# EAGLE design STM32F429VIT6-v1.0.0 (EAGLE 7.7.0)

## Sheet 1 of 3
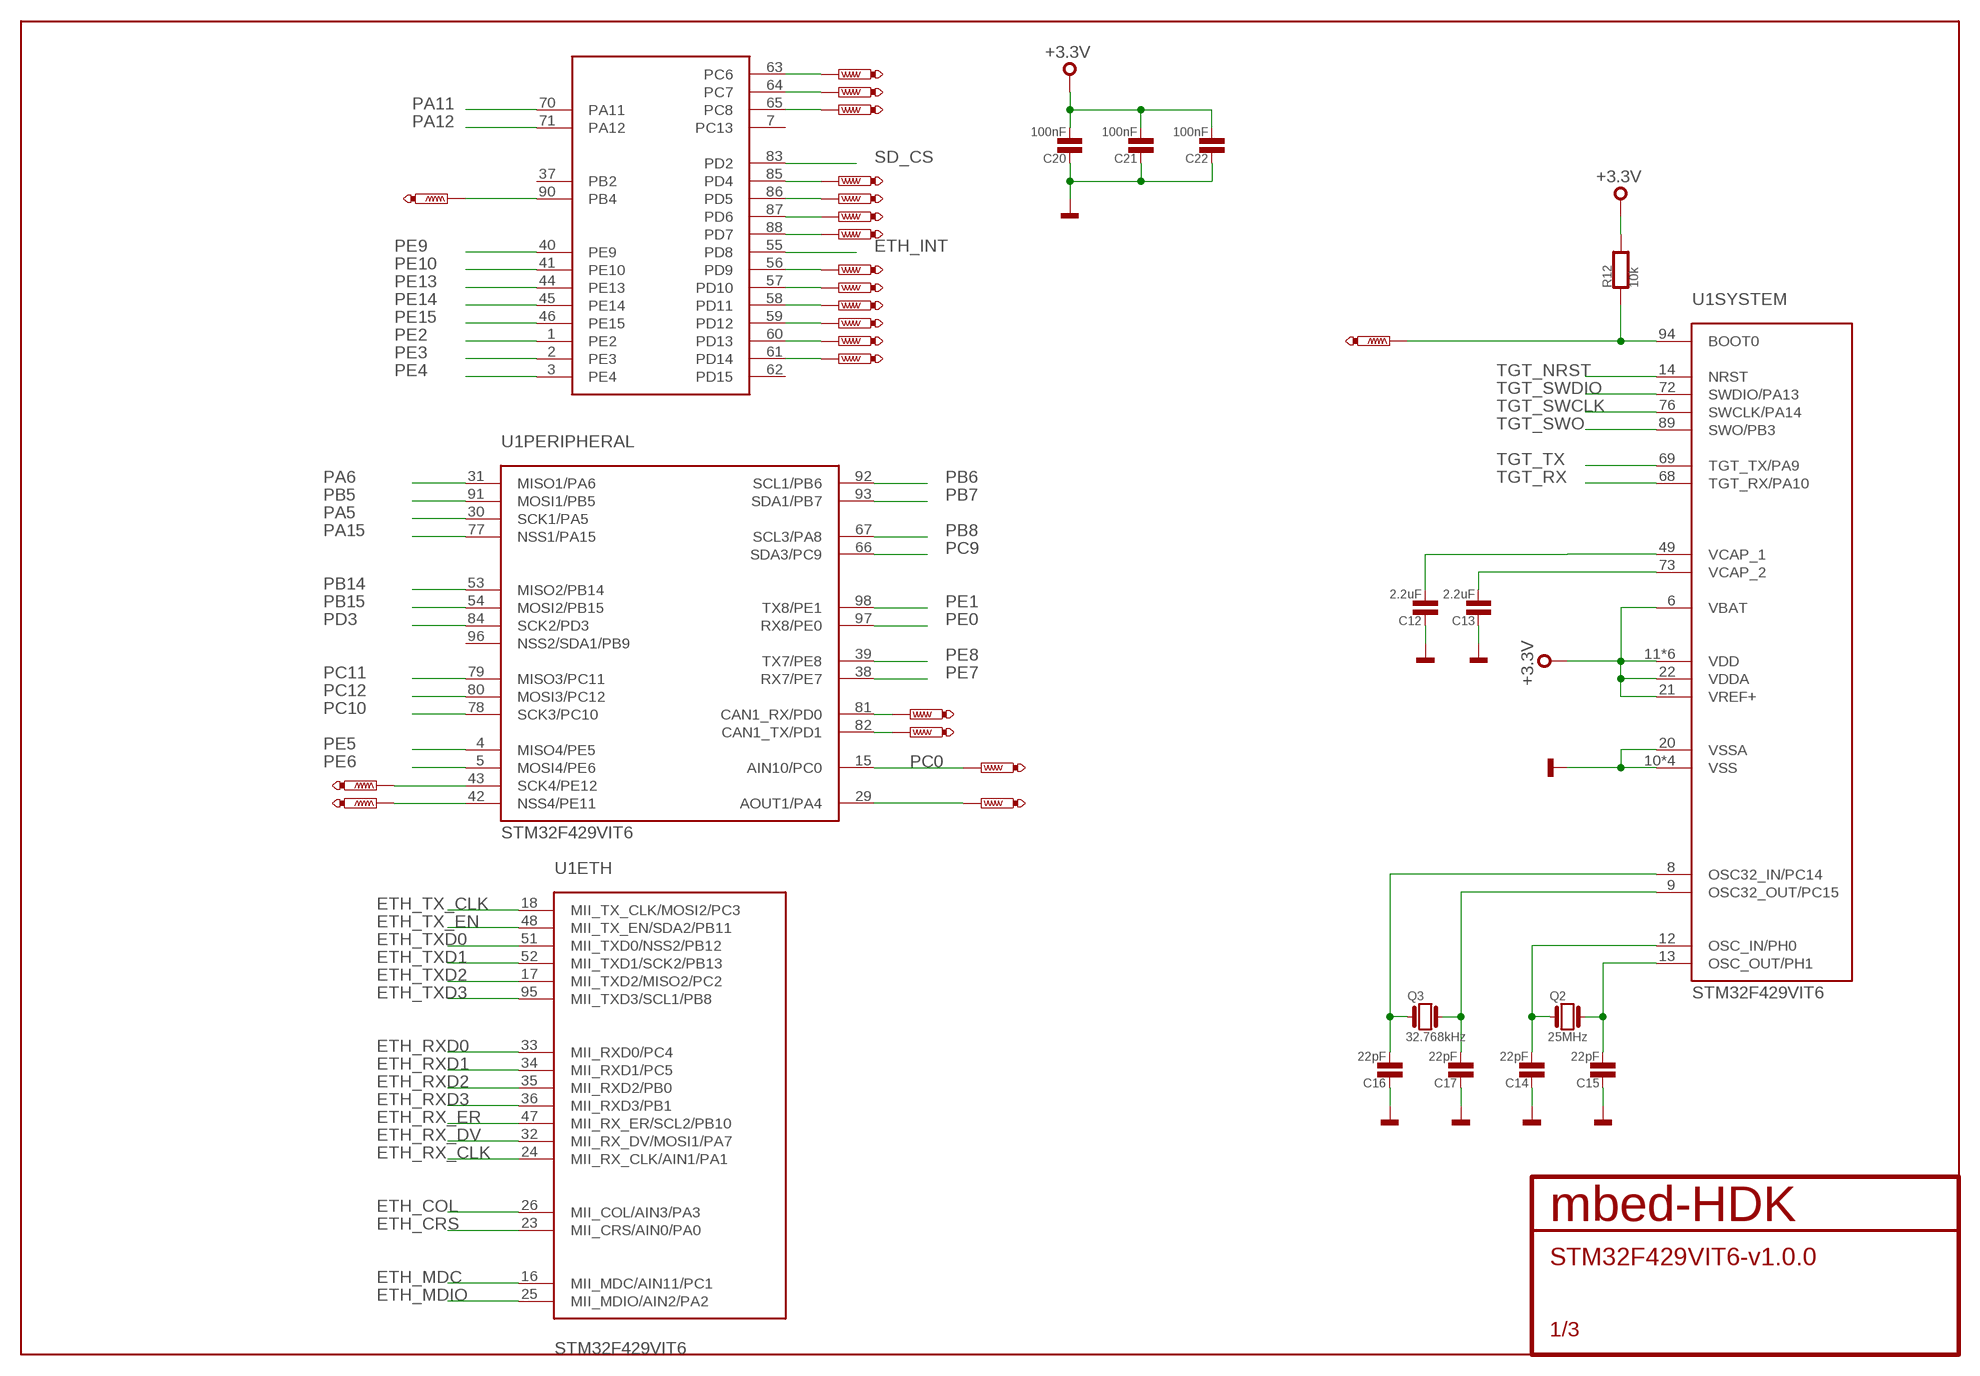
[diagram p0: schematic, sheet 1]

### Parts
C12  2.2uF  C0402  [0402]
C13  2.2uF  C0402  [0402]
C14  22pF  C0603  [0603]
C15  22pF  C0603  [0603]
C16  22pF  C0603  [0603]
C17  22pF  C0603  [0603]
C20  100nF  C0402  [0402]
C21  100nF  C0402  [0402]
C22  100nF  C0402  [0402]
Q2  25MHz  GENERIC-CRYSTAL_3.2X2.5  [3.2X.2.5]
Q3  32.768kHz  GENERIC-CRYSTAL_FC135  [FC135]
R12  10k  R0402  [0402]
TP3  PTR1TP06R  [TP06R]
TP4  PTR1TP06R  [TP06R]
TP5  PTR1TP06R  [TP06R]
TP6  PTR1TP06R  [TP06R]
TP7  PTR1TP06R  [TP06R]
TP8  PTR1TP06R  [TP06R]
TP9  PTR1TP06R  [TP06R]
TP10  PTR1TP06R  [TP06R]
TP11  PTR1TP06R  [TP06R]
TP12  PTR1TP06R  [TP06R]
TP13  PTR1TP06R  [TP06R]
TP15  PTR1TP06R  [TP06R]
TP16  PTR1TP06R  [TP06R]
TP17  PTR1TP06R  [TP06R]
TP18  PTR1TP06R  [TP06R]
TP19  PTR1TP06R  [TP06R]
TP20  PTR1TP06R  [TP06R]
TP21  PTR1TP06R  [TP06R]
TP22  PTR1TP06R  [TP06R]
TP23  PTR1TP06R  [TP06R]
TP24  PTR1TP06R  [TP06R]
U1  STM32F429VIT6  [QFP50P1600X1600X160-100N]

### Nets
+3.3V: C20.2 C21.2 C22.2 R12.2 U1.6(SYSTEM:VBAT) U1.11(SYSTEM:VDD) U1.19(SYSTEM:VDD) U1.21(SYSTEM:VREF+) U1.22(SYSTEM:VDDA) U1.28(SYSTEM:VDD) U1.50(SYSTEM:VDD) U1.75(SYSTEM:VDD) U1.100(SYSTEM:VDD) ; also sheet 2,3
ETH_COL: U1.26(ETH:MII_COL/AIN3/PA3) ; also sheet 2
ETH_CRS: U1.23(ETH:MII_CRS/AIN0/PA0) ; also sheet 2
ETH_INT: U1.55(GPIO:PD8) ; also sheet 2
ETH_MDC: U1.16(ETH:MII_MDC/AIN11/PC1) ; also sheet 2
ETH_MDIO: U1.25(ETH:MII_MDIO/AIN2/PA2) ; also sheet 2
ETH_RX_CLK: U1.24(ETH:MII_RX_CLK/AIN1/PA1) ; also sheet 2
ETH_RX_DV: U1.32(ETH:MII_RX_DV/MOSI1/PA7) ; also sheet 2
ETH_RX_ER: U1.47(ETH:MII_RX_ER/SCL2/PB10) ; also sheet 2
ETH_RXD0: U1.33(ETH:MII_RXD0/PC4) ; also sheet 2
ETH_RXD1: U1.34(ETH:MII_RXD1/PC5) ; also sheet 2
ETH_RXD2: U1.35(ETH:MII_RXD2/PB0) ; also sheet 2
ETH_RXD3: U1.36(ETH:MII_RXD3/PB1) ; also sheet 2
ETH_TX_CLK: U1.18(ETH:MII_TX_CLK/MOSI2/PC3) ; also sheet 2
ETH_TX_EN: U1.48(ETH:MII_TX_EN/SDA2/PB11) ; also sheet 2
ETH_TXD0: U1.51(ETH:MII_TXD0/NSS2/PB12) ; also sheet 2
ETH_TXD1: U1.52(ETH:MII_TXD1/SCK2/PB13) ; also sheet 2
ETH_TXD2: U1.17(ETH:MII_TXD2/MISO2/PC2) ; also sheet 2
ETH_TXD3: U1.95(ETH:MII_TXD3/SCL1/PB8) ; also sheet 2
GND: C12.1 C13.1 C14.1 C15.1 C16.1 C17.1 C20.1 C21.1 C22.1 U1.10(SYSTEM:VSS) U1.20(SYSTEM:VSSA) U1.27(SYSTEM:VSS) U1.74(SYSTEM:VSS) U1.99(SYSTEM:VSS) ; also sheet 2,3
N$3: R12.1 TP6.TP U1.94(SYSTEM:BOOT0)
N$8: TP3.TP U1.81(PERIPHERAL:CAN1_RX/PD0)
N$10: C12.2 U1.49(SYSTEM:VCAP_1)
N$11: C14.2 Q2.P$1 U1.12(SYSTEM:OSC_IN/PH0)
N$12: C15.2 Q2.P$3 U1.13(SYSTEM:OSC_OUT/PH1)
N$13: C17.2 Q3.X2 U1.9(SYSTEM:OSC32_OUT/PC15)
N$14: C13.2 U1.73(SYSTEM:VCAP_2)
N$15: C16.2 Q3.X1 U1.8(SYSTEM:OSC32_IN/PC14)
N$16: TP4.TP U1.82(PERIPHERAL:CAN1_TX/PD1)
N$17: TP7.TP U1.29(PERIPHERAL:AOUT1/PA4)
N$18: TP8.TP U1.42(PERIPHERAL:NSS4/PE11)
N$19: TP9.TP U1.43(PERIPHERAL:SCK4/PE12)
N$20: TP18.TP U1.88(GPIO:PD7)
N$21: TP11.TP U1.90(GPIO:PB4)
N$22: TP21.TP U1.85(GPIO:PD4)
N$23: TP20.TP U1.86(GPIO:PD5)
N$24: TP19.TP U1.87(GPIO:PD6)
N$25: TP17.TP U1.65(GPIO:PC8)
N$26: TP16.TP U1.64(GPIO:PC7)
N$28: TP15.TP U1.63(GPIO:PC6)
N$29: TP12.TP U1.60(GPIO:PD13)
N$31: TP13.TP U1.56(GPIO:PD9)
N$32: TP10.TP U1.57(GPIO:PD10)
N$34: TP22.TP U1.58(GPIO:PD11)
N$35: TP23.TP U1.59(GPIO:PD12)
N$36: TP24.TP U1.61(GPIO:PD14)
PA5: U1.30(PERIPHERAL:SCK1/PA5) ; also sheet 3
PA6: U1.31(PERIPHERAL:MISO1/PA6) ; also sheet 3
PA11: U1.70(GPIO:PA11) ; also sheet 3
PA12: U1.71(GPIO:PA12) ; also sheet 3
PA15: U1.77(PERIPHERAL:NSS1/PA15) ; also sheet 3
PB5: U1.91(PERIPHERAL:MOSI1/PB5) ; also sheet 3
PB6: U1.92(PERIPHERAL:SCL1/PB6) ; also sheet 3
PB7: U1.93(PERIPHERAL:SDA1/PB7) ; also sheet 3
PB8: U1.67(PERIPHERAL:SCL3/PA8) ; also sheet 3
PB14: U1.53(PERIPHERAL:MISO2/PB14) ; also sheet 3
PB15: U1.54(PERIPHERAL:MOSI2/PB15) ; also sheet 3
PC0: TP5.TP U1.15(PERIPHERAL:AIN10/PC0) ; also sheet 3
PC9: U1.66(PERIPHERAL:SDA3/PC9) ; also sheet 3
PC10: U1.78(PERIPHERAL:SCK3/PC10) ; also sheet 3
PC11: U1.79(PERIPHERAL:MISO3/PC11) ; also sheet 3
PC12: U1.80(PERIPHERAL:MOSI3/PC12) ; also sheet 3
PD3: U1.84(PERIPHERAL:SCK2/PD3) ; also sheet 3
PE0: U1.97(PERIPHERAL:RX8/PE0) ; also sheet 3
PE1: U1.98(PERIPHERAL:TX8/PE1) ; also sheet 3
PE2: U1.1(GPIO:PE2) ; also sheet 3
PE3: U1.2(GPIO:PE3) ; also sheet 3
PE4: U1.3(GPIO:PE4) ; also sheet 3
PE5: U1.4(PERIPHERAL:MISO4/PE5) ; also sheet 3
PE6: U1.5(PERIPHERAL:MOSI4/PE6) ; also sheet 3
PE7: U1.38(PERIPHERAL:RX7/PE7) ; also sheet 3
PE8: U1.39(PERIPHERAL:TX7/PE8) ; also sheet 3
PE9: U1.40(GPIO:PE9) ; also sheet 3
PE10: U1.41(GPIO:PE10) ; also sheet 3
PE13: U1.44(GPIO:PE13) ; also sheet 3
PE14: U1.45(GPIO:PE14) ; also sheet 3
PE15: U1.46(GPIO:PE15) ; also sheet 3
SD_CS: U1.83(GPIO:PD2) ; also sheet 3
TGT_NRST: U1.14(SYSTEM:NRST) ; also sheet 2,3
TGT_RX: U1.68(SYSTEM:TGT_RX/PA10) ; also sheet 3
TGT_SWCLK: U1.76(SYSTEM:SWCLK/PA14) ; also sheet 3
TGT_SWDIO: U1.72(SYSTEM:SWDIO/PA13) ; also sheet 3
TGT_SWO: U1.89(SYSTEM:SWO/PB3) ; also sheet 3
TGT_TX: U1.69(SYSTEM:TGT_TX/PA9) ; also sheet 3
Unconnected: U1.7(GPIO:PC13) U1.37(GPIO:PB2) U1.62(GPIO:PD15) U1.96(PERIPHERAL:NSS2/SDA1/PB9)

## Sheet 2 of 3
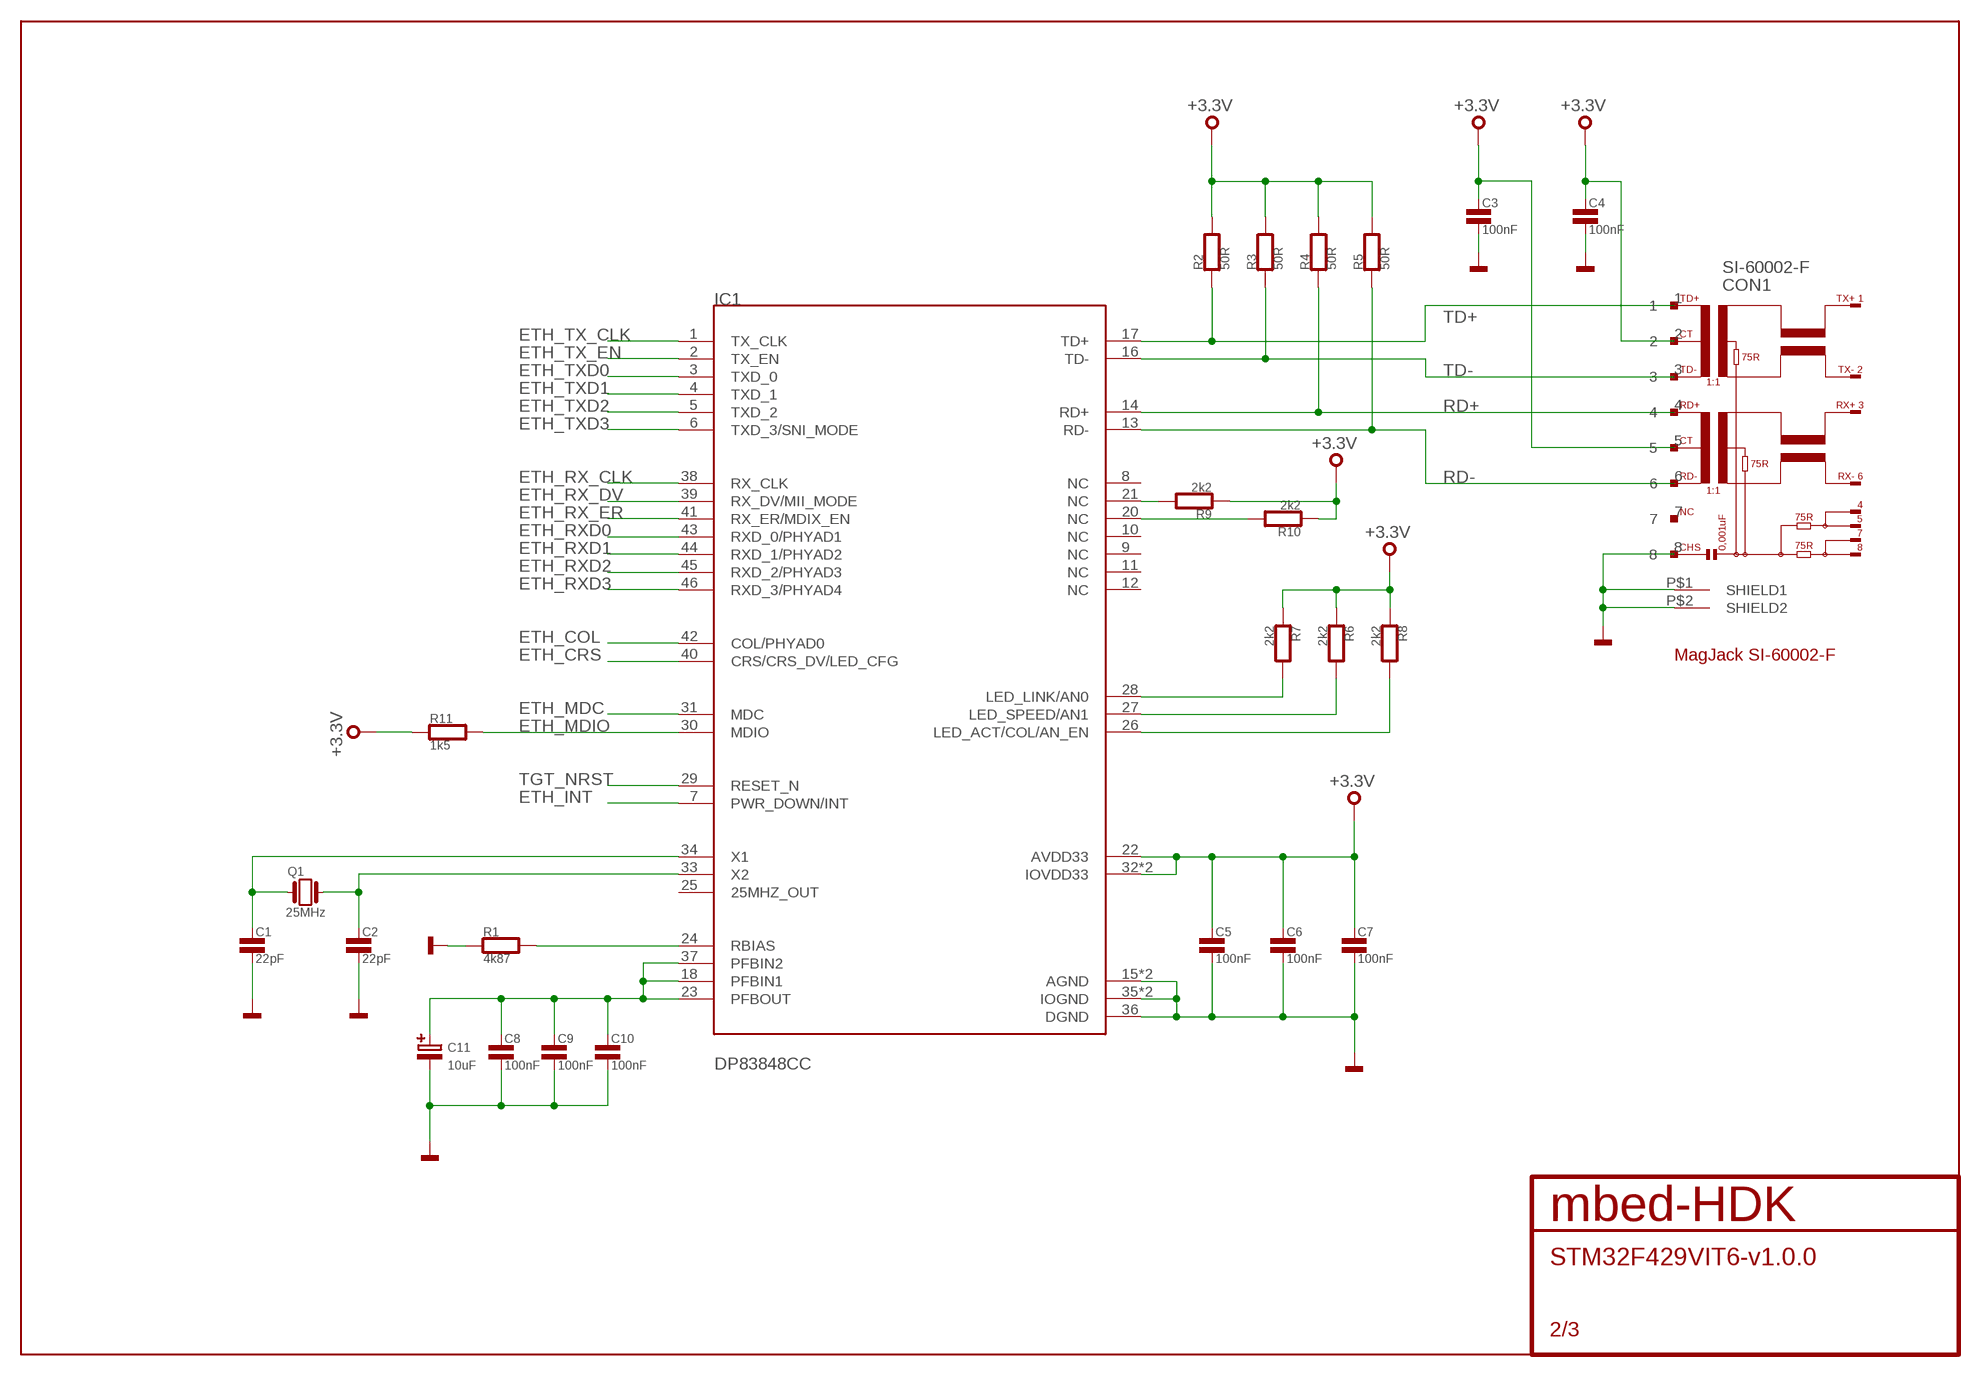
[diagram p1: schematic, sheet 2]

### Parts
C1  22pF  C0402  [0402]
C2  22pF  C0402  [0402]
C3  100nF  C0402  [0402]
C4  100nF  C0402  [0402]
C5  100nF  C0402  [0402]
C6  100nF  C0402  [0402]
C7  100nF  C0402  [0402]
C8  100nF  C0402  [0402]
C9  100nF  C0402  [0402]
C10  100nF  C0402  [0402]
C11  10uF  C-POLA  [SMC_A]
CON1  SI-60002-F  [RJ45]
IC1  DP83848CC  [LQFP-48]
Q1  25MHz  GENERIC-CRYSTAL_3.2X2.5  [3.2X.2.5]
R1  4k87  R0402  [0402]
R2  50R  R0402  [0402]
R3  50R  R0402  [0402]
R4  50R  R0402  [0402]
R5  50R  R0402  [0402]
R6  2k2  R0402  [0402]
R7  2k2  R0402  [0402]
R8  2k2  R0402  [0402]
R9  2k2  R0402  [0402]
R10  2k2  R0402  [0402]
R11  1k5  R0402  [0402]

### Nets
+3.3V: C3.1 C4.1 C5.1 C6.1 C7.1 CON1.2 CON1.5 IC1.22(AVDD33) IC1.32(IOVDD33) IC1.48(IOVDD33) R2.2 R3.2 R4.2 R5.2 R6.1 R7.1 R8.1 R9.1 R10.1 R11.1 ; also sheet 1,3
ETH_COL: IC1.42(COL/PHYAD0) ; also sheet 1
ETH_CRS: IC1.40(CRS/CRS_DV/LED_CFG) ; also sheet 1
ETH_INT: IC1.7(PWR_DOWN/INT) ; also sheet 1
ETH_MDC: IC1.31(MDC) ; also sheet 1
ETH_MDIO: IC1.30(MDIO) R11.2 ; also sheet 1
ETH_RX_CLK: IC1.38(RX_CLK) ; also sheet 1
ETH_RX_DV: IC1.39(RX_DV/MII_MODE) ; also sheet 1
ETH_RX_ER: IC1.41(RX_ER/MDIX_EN) ; also sheet 1
ETH_RXD0: IC1.43(RXD_0/PHYAD1) ; also sheet 1
ETH_RXD1: IC1.44(RXD_1/PHYAD2) ; also sheet 1
ETH_RXD2: IC1.45(RXD_2/PHYAD3) ; also sheet 1
ETH_RXD3: IC1.46(RXD_3/PHYAD4) ; also sheet 1
ETH_TX_CLK: IC1.1(TX_CLK) ; also sheet 1
ETH_TX_EN: IC1.2(TX_EN) ; also sheet 1
ETH_TXD0: IC1.3(TXD_0) ; also sheet 1
ETH_TXD1: IC1.4(TXD_1) ; also sheet 1
ETH_TXD2: IC1.5(TXD_2) ; also sheet 1
ETH_TXD3: IC1.6(TXD_3/SNI_MODE) ; also sheet 1
GND: C1.2 C2.2 C3.2 C4.2 C5.2 C6.2 C7.2 C8.2 C9.2 C10.2 C11.- CON1.8 CON1.P$1(SHIELD1) CON1.P$2(SHIELD2) IC1.15(AGND) IC1.19(AGND) IC1.35(IOGND) IC1.36(DGND) IC1.47(IOGND) R1.1 ; also sheet 1,3
N$1: C1.1 IC1.34(X1) Q1.P$1
N$2: C2.1 IC1.33(X2) Q1.P$3
N$4: IC1.28(LED_LINK/AN0) R7.2
N$5: IC1.24(RBIAS) R1.2
N$6: IC1.27(LED_SPEED/AN1) R6.2
N$7: IC1.26(LED_ACT/COL/AN_EN) R8.2
N$9: IC1.21(NC) R9.2
N$27: IC1.20(NC) R10.2
N$33: C8.1 C9.1 C10.1 C11.+ IC1.18(PFBIN1) IC1.23(PFBOUT) IC1.37(PFBIN2)
RD+: CON1.4 IC1.14(RD+) R4.1
RD-: CON1.6 IC1.13(RD-) R5.1
TD+: CON1.1 IC1.17(TD+) R2.1
TD-: CON1.3 IC1.16(TD-) R3.1
TGT_NRST: IC1.29(RESET_N) ; also sheet 1,3
Unconnected: CON1.7 IC1.8(NC) IC1.9(NC) IC1.10(NC) IC1.11(NC) IC1.12(NC) IC1.25(25MHZ_OUT)

## Sheet 3 of 3
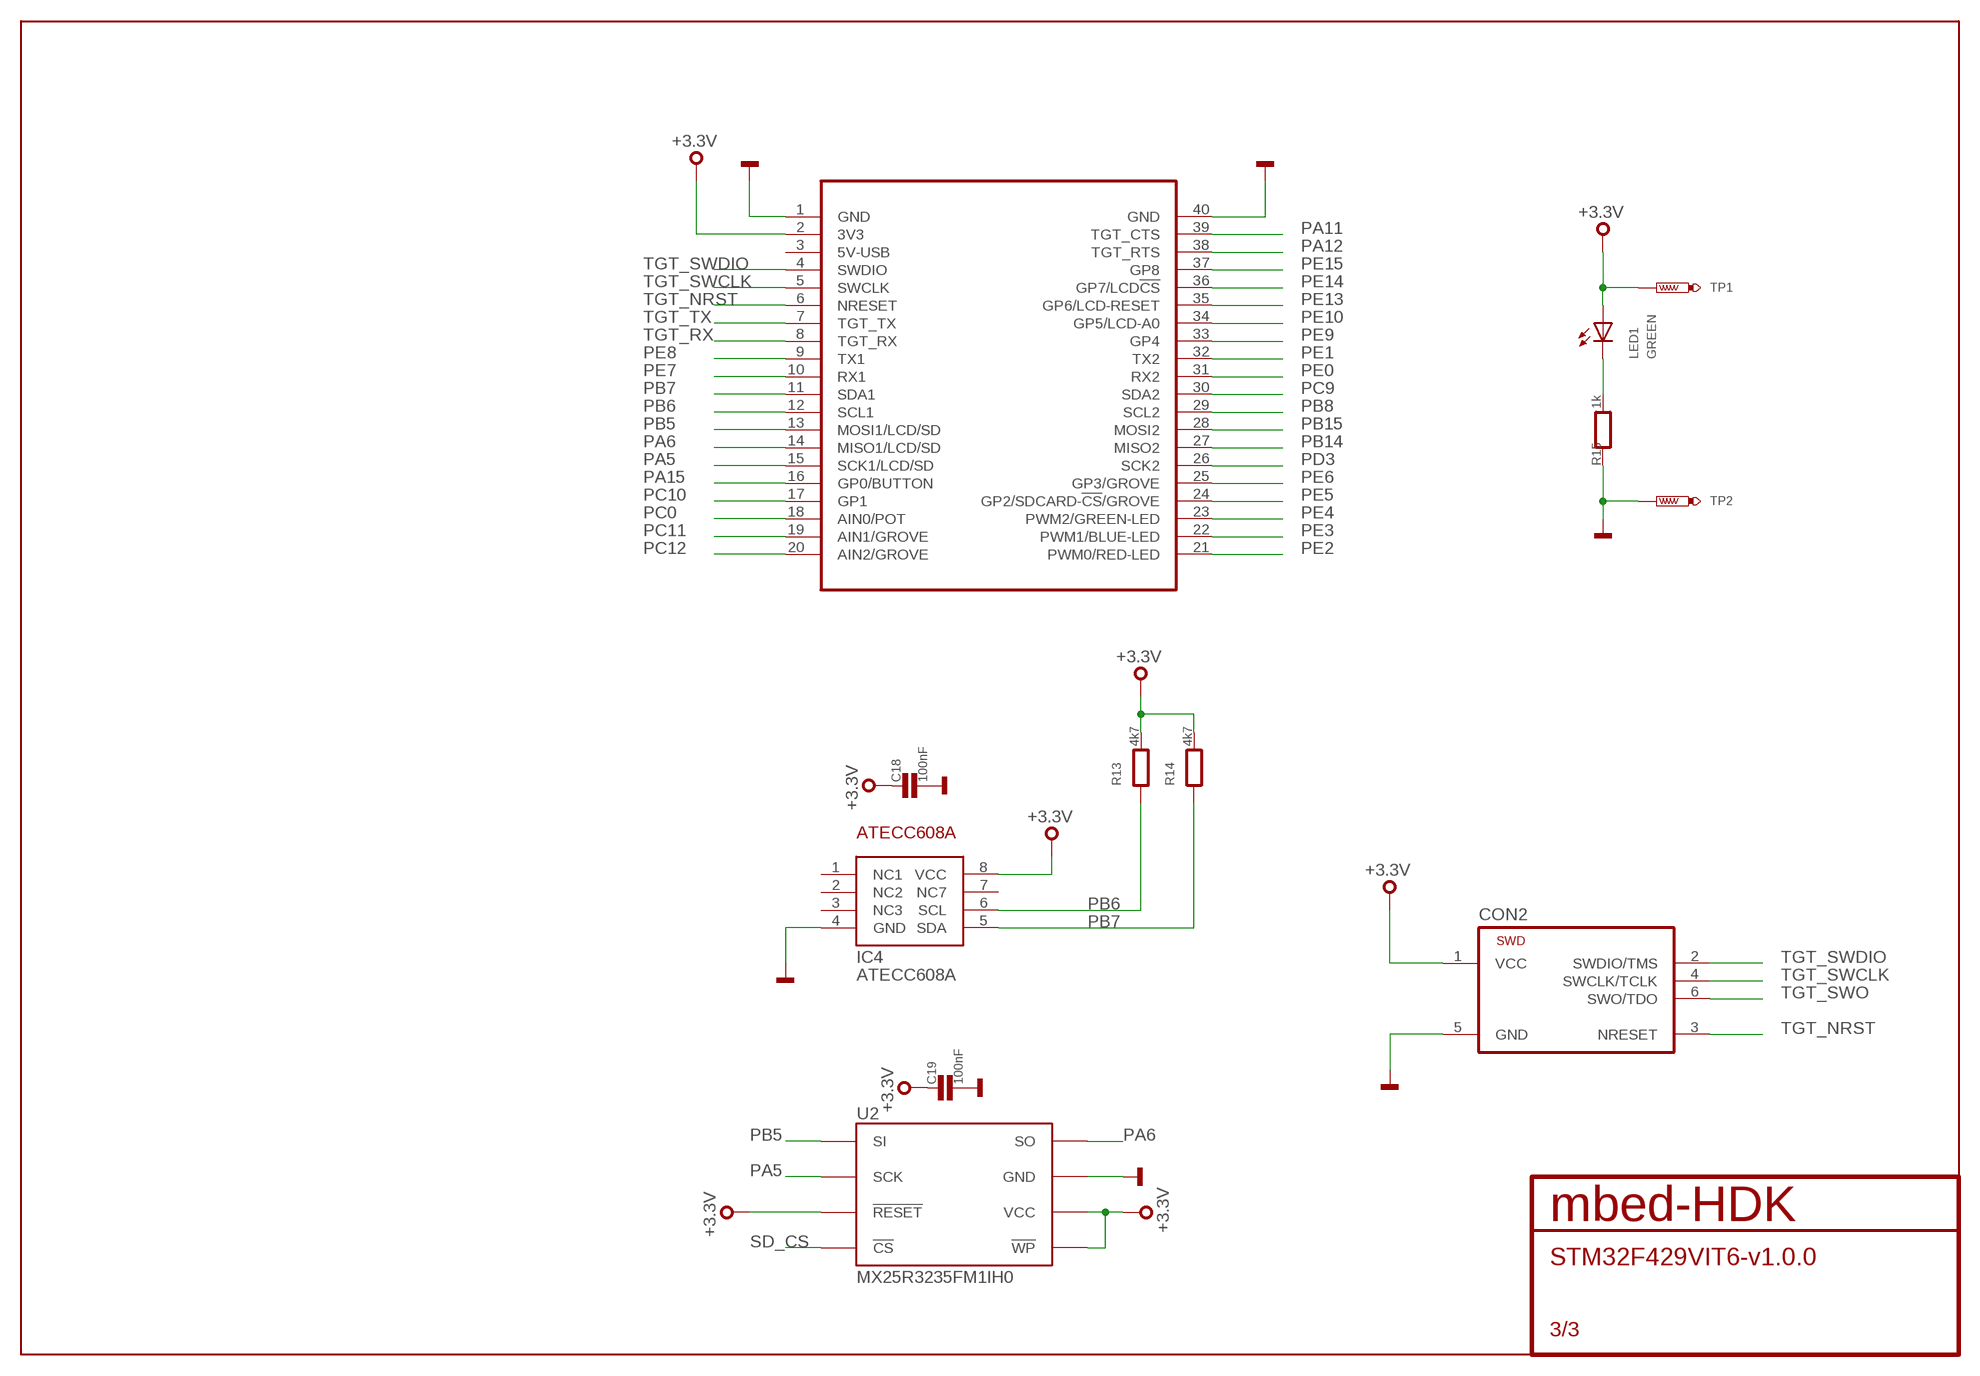
[diagram p2: schematic, sheet 3]

### Parts
C18  100nF  CAPACITOR0402  [0402]
C19  100nF  CAPACITOR0402  [0402]
CON2  TC2030-CTX-NL  [TC2030-CTX-NL]
IC4  ATECC608A  [SO8]
LED1  GREEN  SMD_LED0603  [CHIPLED_0603]
MOD1  MODULE_DAUGHTER  [MODULE_DAUGHTER]
R13  4k7  RESISTOR0402  [0402]
R14  4k7  RESISTOR0402  [0402]
R15  1k  RESISTOR0603  [0603]
TP1  TEST-POINT-50R-PTH  [TP50-PTH]
TP2  TEST-POINT-50R-PTH  [TP50-PTH]
U2  MX25R3235FM1IH0  [SO8]

### Nets
+3.3V: C18.1 C19.1 CON2.1(VCC) IC4.8(VCC) LED1.A MOD1.2(3V3) R13.2 R14.2 TP1.TP U2.3(!WP) U2.7(!RESET) U2.8(VCC) ; also sheet 1,2
GND: C18.2 C19.2 CON2.5(GND) IC4.4(GND) MOD1.1(GND) MOD1.40(GND) R15.1 TP2.TP U2.4(GND) ; also sheet 1,2
PA5: MOD1.15(SCK1/LCD/SD) U2.6(SCK) ; also sheet 1
PA6: MOD1.14(MISO1/LCD/SD) U2.2(SO) ; also sheet 1
PA11: MOD1.39(TGT_CTS) ; also sheet 1
PA12: MOD1.38(TGT_RTS) ; also sheet 1
PA15: MOD1.16(GP0/BUTTON) ; also sheet 1
PA_1: LED1.C R15.2
PB5: MOD1.13(MOSI1/LCD/SD) U2.5(SI) ; also sheet 1
PB6: IC4.6(SCL) MOD1.12(SCL1) R13.1 ; also sheet 1
PB7: IC4.5(SDA) MOD1.11(SDA1) R14.1 ; also sheet 1
PB8: MOD1.29(SCL2) ; also sheet 1
PB14: MOD1.27(MISO2) ; also sheet 1
PB15: MOD1.28(MOSI2) ; also sheet 1
PC0: MOD1.18(AIN0/POT) ; also sheet 1
PC9: MOD1.30(SDA2) ; also sheet 1
PC10: MOD1.17(GP1) ; also sheet 1
PC11: MOD1.19(AIN1/GROVE) ; also sheet 1
PC12: MOD1.20(AIN2/GROVE) ; also sheet 1
PD3: MOD1.26(SCK2) ; also sheet 1
PE0: MOD1.31(RX2) ; also sheet 1
PE1: MOD1.32(TX2) ; also sheet 1
PE2: MOD1.21(PWM0/RED-LED) ; also sheet 1
PE3: MOD1.22(PWM1/BLUE-LED) ; also sheet 1
PE4: MOD1.23(PWM2/GREEN-LED) ; also sheet 1
PE5: MOD1.24(GP2/SDCARD-!CS!/GROVE) ; also sheet 1
PE6: MOD1.25(GP3/GROVE) ; also sheet 1
PE7: MOD1.10(RX1) ; also sheet 1
PE8: MOD1.9(TX1) ; also sheet 1
PE9: MOD1.33(GP4) ; also sheet 1
PE10: MOD1.34(GP5/LCD-A0) ; also sheet 1
PE13: MOD1.35(GP6/LCD-RESET) ; also sheet 1
PE14: MOD1.36(GP7/LCD!CS) ; also sheet 1
PE15: MOD1.37(GP8) ; also sheet 1
SD_CS: U2.1(!CS) ; also sheet 1
TGT_NRST: CON2.3(NRESET) MOD1.6(NRESET) ; also sheet 1,2
TGT_RX: MOD1.8(TGT_RX) ; also sheet 1
TGT_SWCLK: CON2.4(SWCLK/TCLK) MOD1.5(SWCLK) ; also sheet 1
TGT_SWDIO: CON2.2(SWDIO/TMS) MOD1.4(SWDIO) ; also sheet 1
TGT_SWO: CON2.6(SWO/TDO) ; also sheet 1
TGT_TX: MOD1.7(TGT_TX) ; also sheet 1
Unconnected: IC4.1(NC1) IC4.2(NC2) IC4.3(NC3) IC4.7(NC7) MOD1.3(5V-USB)

## Library data of the parts
C1-C10 C12-C17 C20-C22 = mbed-HDK-RLC:C: Capacitor
C11 = mbed-HDK-RLC:C-POL: Polarised capacitor
C18 C19 = mbed-HDK-RLC:CAPACITOR: Capacitor
CON1 = mbed-HDK-Connector:SI-60002-F: RJ45 Right Angle; MF: Stewart Connector; MFN: SI-60002-F; OC-DIGIKEY: 380-1105-ND; OC-NEWARK: 24M7449
CON2 = mbed-HDK-Connector:TC2030-CTX: Tag-Connect In Circuit Programming & Debug Cable 6 Pin
IC1 = mbed-HDK-IC:DP83848C
IC4 = mbed-HDK-MF-ATMEL:ATECC608A
LED1 = mbed-HDK-Optical:SMD_LED: LED SMD, Colour Red; MF: Wurth Electronics Inc; MFN: 150060RS75000; OC-DIGIKEY: 732-4978-1-ND; OC-MOUSER: 710-150060RS75000; OC-NEWARK: 2322071
MOD1 = mbed-HDK-misc-Board:MODULE_DAUGHTER
Q1-Q3 = mbed-HDK-Oscillator:GENERIC-CRYSTAL: GENERIC Crystal
R1-R12 = mbed-HDK-RLC:R: Resistor
R13-R15 = mbed-HDK-RLC:RESISTOR: Resistor
TP1 TP2 = mbed-HDK:TEST-POINT
TP3-TP13 TP15-TP24 = testpad:PTR1: TEST PIN
U1 = mbed-HDK-MF-ST:STM32F429VIT6
U2 = mbed-HDK-IC:MX25R3235FM1IH0: Serial Flash 32 Mb 80 Mhz; MF: Macronix; MFN: MX25R3235FM1IH0; OC-DIGIKEY: 1092-1175-ND

## Board
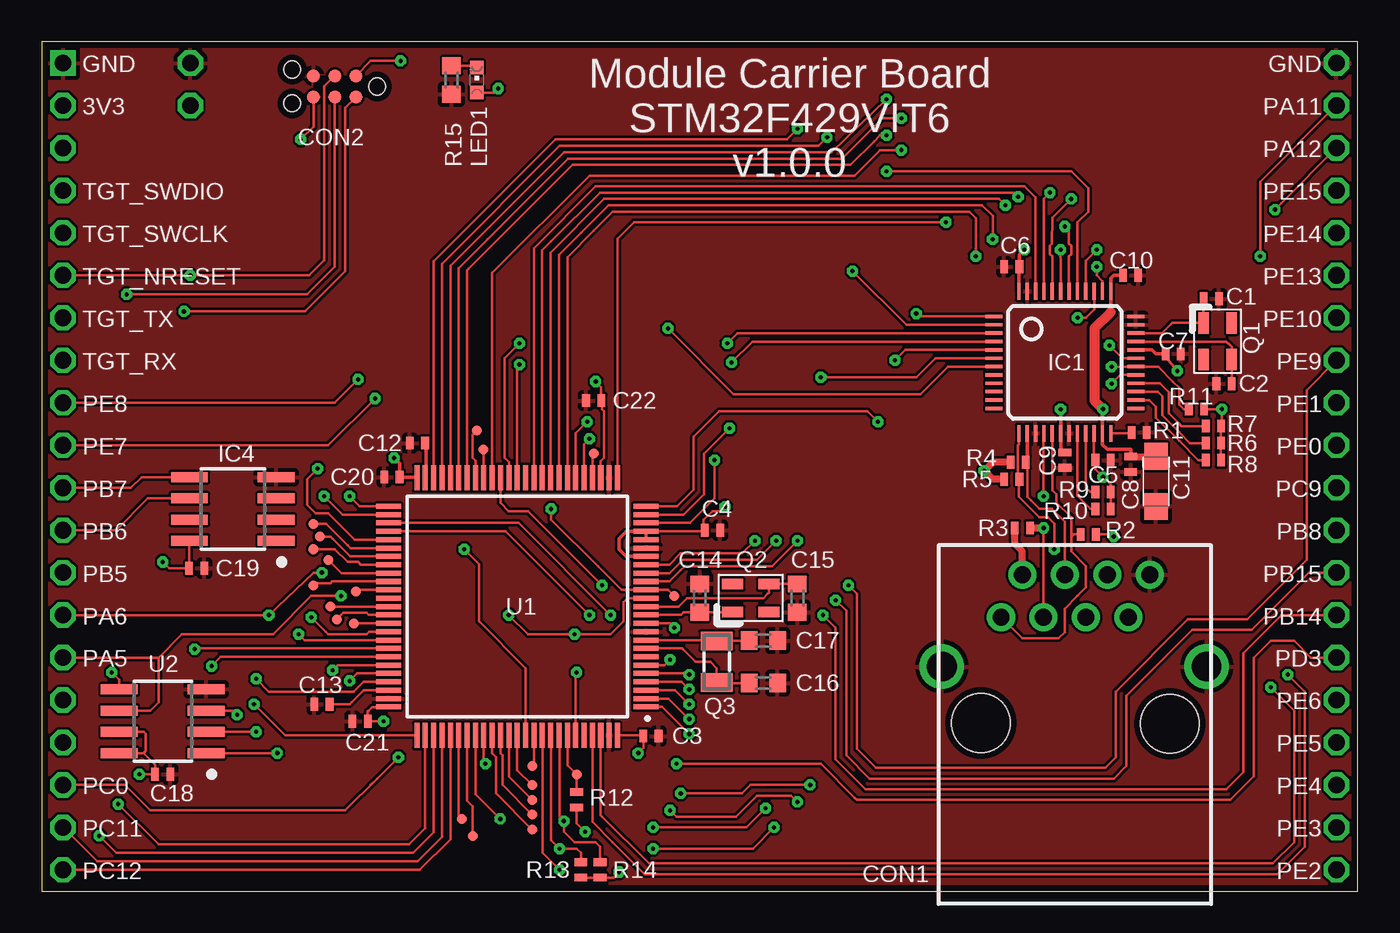
[diagram p3: board, top side]
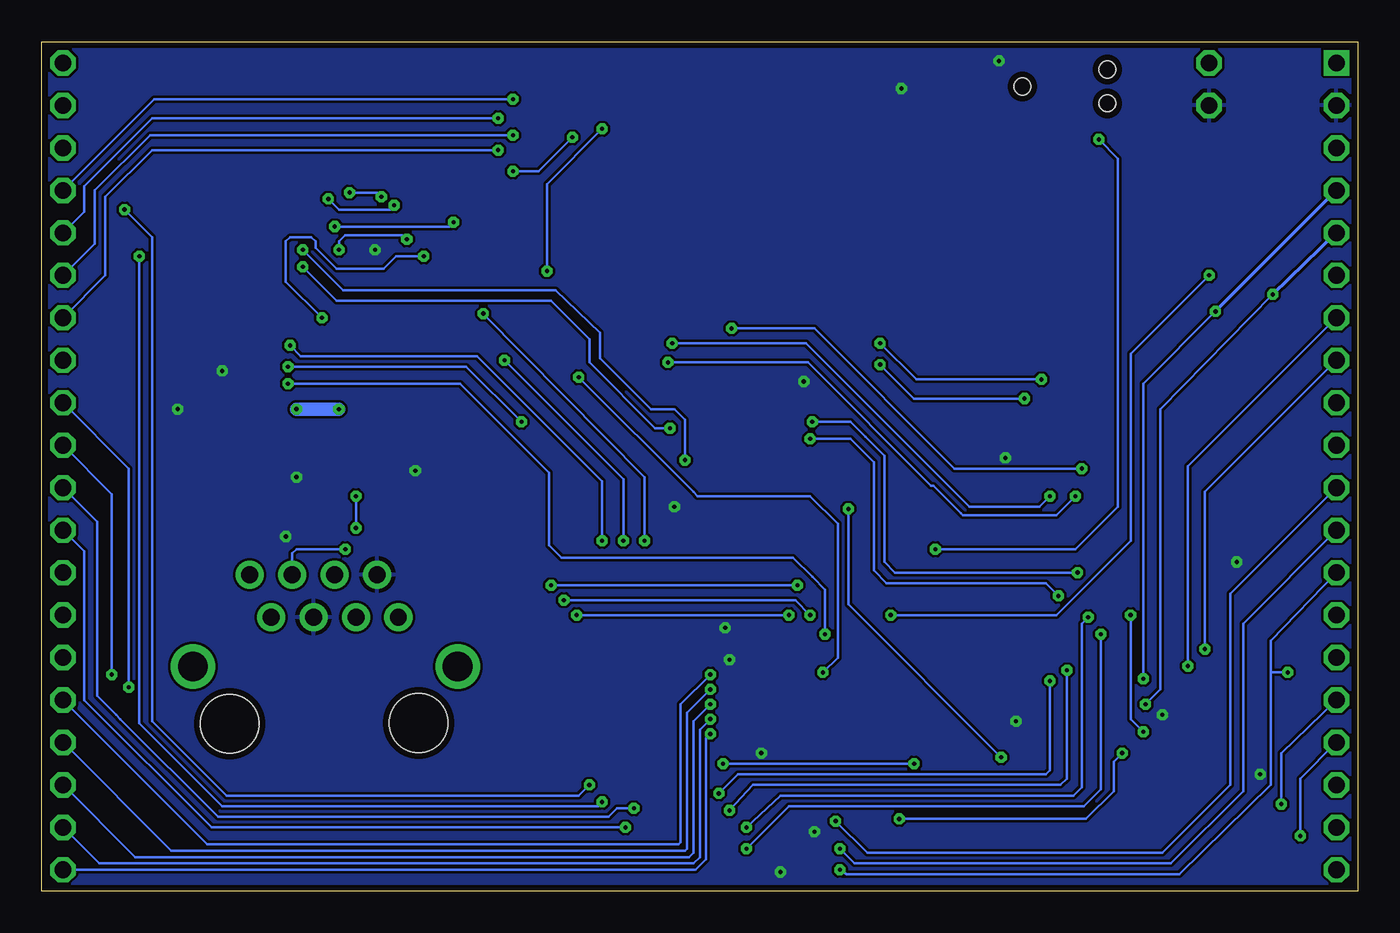
[diagram p4: board, bottom side, seen from below]

Size 78.74 x 50.8 mm. Coordinates in mm from the lower left corner, seen from the top.
Copper layers ((1*16)): Top 0.035mm / dielectric 0.8mm / Bottom 0.035mm
Design rules "mbed-HDK-6-6-2-layer": minimum track width 6mil, minimum drill 9mil, track to track 6mil, track to pad 6mil, pad to pad 6mil, via to via 6mil, smd to smd 6mil, copper to edge 15mil, drill to drill 8mil, minimum pad ring 10mil, minimum via ring 8mil, stop-mask expansion 4mil, vias tented up to drill 0mil, thermal gap 10mil

### Footprints (pad centres in the part's own frame; a part is rotated, then mirrored left to right if it is on the bottom)
0402 = smd 0.457 x 0.762: 1 -0.457,0; 2 0.457,0
SMC_A = smd 1.6 x 1.4: + -1.5,0; - 1.5,0
0603 = smd 1 x 1.1: 1 -0.85,0; 2 0.85,0
RJ45 = drill 1.016 pad 1.676: 1 0,0; 2 -1.27,-2.54; 3 -2.54,0; 4 -3.81,-2.54; 5 -5.08,0; 6 -6.35,-2.54; 7 -7.62,0; 8 -8.89,-2.54 | drill 1.778: P$1 -12.3,2.95; P$2 3.55,2.95 | hole 3.5: -10.09,6.38; 1.21,6.33
TC2030-CTX-NL = smd 0.787 x 0.787: 1 -1.27,-0.635; 2 -1.27,0.635; 3 0,-0.635; 4 0,0.635; 5 1.27,-0.635; 6 1.27,0.635 | hole 0.991: -2.54,0; 2.54,1.016; 2.54,-1.016
LQFP-48 = smd 0.2 x 1: 1 -2.75,-4.25; 2 -2.25,-4.25; 3 -1.75,-4.25; 4 -1.25,-4.25; 5 -0.75,-4.25; 6 -0.25,-4.25; 7 0.25,-4.25; 8 0.75,-4.25; 9 1.25,-4.25; 10 1.75,-4.25; 11 2.25,-4.25; 12 2.75,-4.25; 25 2.75,4.25; 26 2.25,4.25; 27 1.75,4.25; 28 1.25,4.25; 29 0.75,4.25; 30 0.25,4.25; 31 -0.25,4.25; 32 -0.75,4.25; 33 -1.25,4.25; 34 -1.75,4.25; 35 -2.25,4.25; 36 -2.75,4.25 | smd 1 x 0.2: 13 4.25,-2.75; 14 4.25,-2.25; 15 4.25,-1.75; 16 4.25,-1.25; 17 4.25,-0.75; 18 4.25,-0.25; 19 4.25,0.25; 20 4.25,0.75; 21 4.25,1.25; 22 4.25,1.75; 23 4.25,2.25; 24 4.25,2.75; 37 -4.25,2.75; 38 -4.25,2.25; 39 -4.25,1.75; 40 -4.25,1.25; 41 -4.25,0.75; 42 -4.25,0.25; 43 -4.25,-0.25; 44 -4.25,-0.75; 45 -4.25,-1.25; 46 -4.25,-1.75; 47 -4.25,-2.25; 48 -4.25,-2.75
SO8 = smd 0.6 x 2.2: 1 -1.905,-2.6; 2 -0.635,-2.6; 3 0.635,-2.6; 4 1.905,-2.6; 5 1.905,2.6; 6 0.635,2.6; 7 -0.635,2.6; 8 -1.905,2.6
CHIPLED_0603 = smd 0.8 x 0.8: A 0,-0.75; C 0,0.75
MODULE_DAUGHTER = drill 1 square: 1 0,0 | drill 1 octagon: 2 0,-2.54; 3 0,-5.08; 4 0,-7.62; 5 0,-10.16; 6 0,-12.7; 7 0,-15.24; 8 0,-17.78; 9 0,-20.32; 10 0,-22.86; 11 0,-25.4; 12 0,-27.94; 13 0,-30.48; 14 0,-33.02; 15 0,-35.56; 16 0,-38.1; 17 0,-40.64; 18 0,-43.18; 19 0,-45.72; 20 0,-48.26; 21 76.2,-48.26; 22 76.2,-45.72; 23 76.2,-43.18; 24 76.2,-40.64; 25 76.2,-38.1; 26 76.2,-35.56; 27 76.2,-33.02; 28 76.2,-30.48; 29 76.2,-27.94; 30 76.2,-25.4; 31 76.2,-22.86; 32 76.2,-20.32; 33 76.2,-17.78; 34 76.2,-15.24; 35 76.2,-12.7; 36 76.2,-10.16; 37 76.2,-7.62; 38 76.2,-5.08; 39 76.2,-2.54; 40 76.2,0
3.2X.2.5 = smd 1.27 x 0.635: P$1 -1.092,-0.838; P$2 1.092,-0.838; P$3 1.092,0.838; P$4 -1.092,0.838
FC135 = smd 1.1 x 1.9: X1 -1.25,0; X2 1.25,0
TP50-PTH = drill 1 octagon: TP 0,0
TP06R = smd 0.6 x 0.6: TP 0,0
QFP50P1600X1600X160-100N = smd 1.5 x 0.3: 1 -7.7,6; 2 -7.7,5.5; 3 -7.7,5; 4 -7.7,4.5; 5 -7.7,4; 6 -7.7,3.5; 7 -7.7,3; 8 -7.7,2.5; 9 -7.7,2; 10 -7.7,1.5; 11 -7.7,1; 12 -7.7,0.5; 13 -7.7,0; 14 -7.7,-0.5; 15 -7.7,-1; 16 -7.7,-1.5; 17 -7.7,-2; 18 -7.7,-2.5; 19 -7.7,-3; 20 -7.7,-3.5; 21 -7.7,-4; 22 -7.7,-4.5; 23 -7.7,-5; 24 -7.7,-5.5; 25 -7.7,-6; 51 7.7,-6; 52 7.7,-5.5; 53 7.7,-5; 54 7.7,-4.5; 55 7.7,-4; 56 7.7,-3.5; 57 7.7,-3; 58 7.7,-2.5; 59 7.7,-2; 60 7.7,-1.5; 61 7.7,-1; 62 7.7,-0.5; 63 7.7,0; 64 7.7,0.5; 65 7.7,1; 66 7.7,1.5; 67 7.7,2; 68 7.7,2.5; 69 7.7,3; 70 7.7,3.5; 71 7.7,4; 72 7.7,4.5; 73 7.7,5; 74 7.7,5.5; 75 7.7,6 | smd 0.3 x 1.5: 26 -6,-7.7; 27 -5.5,-7.7; 28 -5,-7.7; 29 -4.5,-7.7; 30 -4,-7.7; 31 -3.5,-7.7; 32 -3,-7.7; 33 -2.5,-7.7; 34 -2,-7.7; 35 -1.5,-7.7; 36 -1,-7.7; 37 -0.5,-7.7; 38 0,-7.7; 39 0.5,-7.7; 40 1,-7.7; 41 1.5,-7.7; 42 2,-7.7; 43 2.5,-7.7; 44 3,-7.7; 45 3.5,-7.7; 46 4,-7.7; 47 4.5,-7.7; 48 5,-7.7; 49 5.5,-7.7; 50 6,-7.7; 76 6,7.7; 77 5.5,7.7; 78 5,7.7; 79 4.5,7.7; 80 4,7.7; 81 3.5,7.7; 82 3,7.7; 83 2.5,7.7; 84 2,7.7; 85 1.5,7.7; 86 1,7.7; 87 0.5,7.7; 88 0,7.7; 89 -0.5,7.7; 90 -1,7.7; 91 -1.5,7.7; 92 -2,7.7; 93 -2.5,7.7; 94 -3,7.7; 95 -3.5,7.7; 96 -4,7.7; 97 -4.5,7.7; 98 -5,7.7; 99 -5.5,7.7; 100 -6,7.7

### Placement (x,y rotation side)
C1  69.98,35.43 0 top
C2  70.74,30.35 180 top
C3  36.45,9.27 0 top
C4  40.13,21.59 0 top
C5  63.5,25.78 0 top
C6  58.04,37.34 180 top
C7  67.69,32.13 0 top
C8  65.15,25.53 270 top
C9  61.21,25.78 270 top
C10  65.15,36.83 0 top
C11  66.67,24.51 270 top
C12  22.48,26.8 0 top
C13  16.76,11.18 0 top
C14  39.37,17.53 270 top
C15  45.21,17.53 90 top
C16  43.18,12.45 180 top
C17  43.18,14.99 180 top
C18  7.24,6.98 0 top
C19  9.27,19.3 0 top
C20  20.95,24.77 0 top
C21  19.05,10.16 0 top
C22  33.02,29.34 0 top
CON1  57.4,16.38 180 top
CON2  17.53,48.13 180 top
IC1  61.21,31.62 270 top
IC4  11.43,22.86 90 top
LED1  26.04,48.51 0 top
MOD1  1.27,49.53 0 top
Q1  70.36,32.89 270 top
Q2  42.42,17.53 0 top
Q3  40.39,13.72 90 top
R1  65.66,27.43 180 top
R2  62.61,21.34 0 top
R3  58.67,21.72 180 top
R4  58.42,25.65 180 top
R5  58.04,24.64 180 top
R6  70.1,26.8 180 top
R7  70.1,27.81 180 top
R8  70.1,25.78 180 top
R9  63.5,23.88 180 top
R10  63.5,22.86 180 top
R11  69.09,28.83 180 top
R12  32,5.46 270 top
R13  32.26,1.27 270 top
R14  33.4,1.27 270 top
R15  24.51,48.51 90 top
TP1  8.89,46.99 0 top
TP2  8.89,49.53 0 top
TP3  25.15,4.32 0 top
TP4  25.78,3.3 0 top
TP5  37.85,17.65 0 top
TP6  32,6.98 0 top
TP7  33.02,26.16 0 top
TP8  26.42,26.42 0 top
TP9  26.04,27.56 0 top
TP10  16.64,21.21 0 top
TP11  29.34,7.49 0 top
TP12  16.26,18.29 0 top
TP13  16.26,21.97 0 top
TP15  17.27,17.02 0 top
TP16  17.65,16.26 0 top
TP17  18.67,16 0 top
TP18  29.34,6.35 270 top
TP19  29.34,5.46 270 top
TP20  29.34,4.57 270 top
TP21  29.34,3.68 270 top
TP22  16.26,20.45 0 top
TP23  17.14,19.81 0 top
TP24  18.8,17.91 0 top
U1  28.45,17.02 180 top
U2  7.24,10.16 90 top

### Tracks (layer width: path | path; a pad name or v marks a point on that pad's centre or on a via)
+3.3V  (via drill 0.25)
  Top 0.152: R11.1 70.1,28.83 v70.61,28.83 70.61,27.86 R7.1 R6.1 R8.1 | IC1.22 62.96,25.86 C5.1 63.04,25.22 v63.5,24.77 63.96,24.31 R9.1 R10.1 | C7.1 67.23,31.95 v67.94,31.12 | R2.2 64.01,21.34 v64.14,21.21 | LED1.A 27.06,47.76 v27.3,48.01 | CON2.1 19.68,49.66 v21.46,49.66 | U1.100 35.95,9.32 C3.1 35.99,8.56 v35.69,8.26 | 39.6,21.52 C4.1 | 39.6,21.52 39.6,22.2 40.13,22.73 40.64,22.73 v40.89,22.99 | 39.6,21.52 U1.22 | C22.2 33.48,30.15 v33.15,30.48 | 33.45,29.31 C22.2 | U1.6 37.27,13.52 v37.59,13.84 | 20.73,11 19.76,11 19.56,10.8 19.51,10.74 C21.2 v20.45,10.16 | R12.2 32,4.06 v32.51,3.56 | U1.11 37.58,16.02 v37.85,15.75 | v7.24,19.69 7.62,19.3 C19.1 8.83,19.33 IC4.8 | v34.54,1.14 34.21,0.81 R14.2 R13.2 | U2.7 6.1,9.52 6.22,9.4 6.22,8.38 6.1,8.26 | 6.1,8.26 U2.8 | 6.1,8.26 6.73,7.62 6.78,7.57 C18.1 v5.84,6.98 | U2.3 11.43,10.8 v11.68,10.54 | U1.28 33.45,25.7 33.66,25.91 33.66,28.7 33.53,28.83 33.53,29.29 C22.2
  Top 0.203: IC1.32 66.43,32.37 66.67,32.13 C7.1 | IC1.48 58.46,37.31 C6.1 58.5,38.05 v58.8,38.35 | U1.19 34.97,20.02 34.93,20.07 34.54,20.45 34.54,21.08 34.98,21.52 U1.22 U1.21 | U1.50 22.4,24.77 C20.2 21.41,25.58 v21.08,25.91 | 20.73,11 U1.75
  Top 0.406: R4.2 56.9,25.65 v56.39,25.15 56.9,24.64 R5.2 | CON1.2 58.67,20.32 58.22,20.78 R3.2
  pour Bottom: 0,0 78.74,0 78.74,50.8 0,50.8
ETH_COL  (via drill 0.25)
  Top 0.152: U1.26 34.45,38.51 34.45,38.58 34.45,39.02 35.43,40.01 44.7,40.01 v54.1,40.01 | IC1.42 61.46,37.97 61.6,38.1 61.6,38.61 61.47,38.73 61.46,39.5 v61.21,39.75
  Bottom 0.152: v61.21,39.75 54.36,39.75 v54.1,40.01
ETH_CRS  (via drill 0.25)
  Top 0.152: U1.23 38.78,22.02 40.26,23.5 v40.26,25.78 | IC1.40 62.46,37.7 v63.12,38.35
  Bottom 0.152: v63.12,38.35 60.71,35.94 57.53,35.94 48.01,35.94 45.34,33.4 45.34,31.88 42.29,28.83 40.89,28.83 40.26,28.19 v40.26,25.78
ETH_INT  (via drill 0.25)
  Top 0.152: U1.55 18.73,21.02 17.14,22.61 16.38,22.61 15.88,23.11 15.88,24.64 v16.51,25.27 | IC1.7 54.23,31.37 52.58,29.72 41.4,29.72 v37.47,33.66
  Bottom 0.152: v16.51,25.27 24.13,25.27 32.51,33.66 v37.47,33.66
ETH_MDC  (via drill 0.25)
  Top 0.152: U1.16 37.57,18.52 38.23,19.18 38.48,19.43 41.91,19.43 43.69,19.43 v45.21,20.96 | IC1.31 64.65,31.87 v63.88,32.64
  Bottom 0.152: v63.88,32.64 63.25,32 52.71,32 45.21,24.51 v45.21,20.96
ETH_MDIO  (via drill 0.25)
  Top 0.152: R11.2 68.33,28.83 68.07,29.08 68.07,30.1 67.69,30.48 66.8,31.37 IC1.30 64.52,31.37 64.39,31.37 v64.01,31.37 | U1.25 38,23.02 38.99,24 38.99,26.92 38.99,27.18 40.51,28.7 49.4,28.7 v50.04,28.07
  Bottom 0.152: v64.01,31.37 53.34,31.37 v50.04,28.07
ETH_RX_CLK  (via drill 0.25)
  Top 0.152: U1.24 38.39,22.52 39.62,23.75 39.62,26.16 v41.15,27.69 | IC1.38 63.46,36.48 63.12,36.83 v63.12,37.34
  Bottom 0.152: v63.12,37.34 61.09,35.31 59.69,35.31 48.26,35.31 45.97,33.02 45.97,31.62 42.04,27.69 v41.15,27.69
ETH_RX_DV  (via drill 0.25)
  Top 0.152: U1.32 31.45,37.92 33.02,39.5 34.16,40.64 44.7,40.64 55.5,40.64 55.88,40.26 55.88,38.48 v55.88,37.97 | v61.98,34.29 62.48,34.29 62.99,34.8 62.99,35.84 IC1.39
  Bottom 0.152: v55.88,37.97 57.53,37.97 58.29,37.21 61.09,37.21 62.36,38.48 62.36,38.86 62.61,39.12 62.99,39.12 63.88,39.12 64.14,38.86 64.14,36.45 v61.98,34.29
ETH_RX_ER  (via drill 0.25)
  Top 0.152: U1.47 23.95,37.52 30.99,44.58 44.7,44.58 46.48,44.58 v46.99,45.09 | v50.55,43.05 61.6,43.05 62.61,42.04 62.61,40.64 61.96,39.99 IC1.41
  Bottom 0.152: v46.99,45.09 49.02,43.05 v50.55,43.05
ETH_RXD0  (via drill 0.25)
  Top 0.152: U1.33 30.95,38.06 32.26,39.37 33.91,41.02 44.7,41.02 56.26,41.02 56.9,40.39 v56.9,38.99 | v60.96,38.35 60.96,37.33 IC1.43
  Bottom 0.152: v56.9,38.99 57.15,39.24 59.05,39.24 60.58,39.24 60.96,38.86 v60.96,38.35
ETH_RXD1  (via drill 0.25)
  Top 0.152: U1.34 30.45,38.07 30.45,38.2 33.66,41.4 44.7,41.4 57.28,41.4 v57.66,41.02 | IC1.44 60.46,37.96 60.33,38.1 60.33,38.61 60.45,38.73 60.46,40.27 v61.6,41.4
  Bottom 0.152: v61.6,41.4 60.96,40.77 57.91,40.77 v57.66,41.02
ETH_RXD2  (via drill 0.25)
  Top 0.152: U1.35 29.95,38.33 30.48,38.86 33.4,41.78 44.58,41.78 | 44.58,41.78 44.7,41.78 | IC1.45 59.96,41.42 v60.33,41.78 | v58.42,41.53 58.17,41.78 44.58,41.78
  Bottom 0.152: v60.33,41.78 58.67,41.78 v58.42,41.53
ETH_RXD3
  Top 0.152: U1.36 29.45,38.47 33.15,42.16 44.7,42.16 58.8,42.16 59.46,41.5 IC1.46
ETH_TX_CLK  (via drill 0.25)
  Top 0.152: U1.18 37.55,19.52 38.23,20.19 41.91,20.19 v42.67,20.96 | v52.32,34.54 52.5,34.37 IC1.1
  Bottom 0.152: v42.67,20.96 42.67,24.77 v52.32,34.54
ETH_TX_EN  (via drill 0.25)
  Top 0.152: U1.48 23.45,30.56 23.45,32.34 23.45,37.67 30.73,44.96 43.69,44.96 44.58,44.96 v45.21,45.59 | IC1.2 51.73,33.87 v48.51,37.08
  Bottom 0.152: v48.51,37.08 48.51,42.29 v45.21,45.59
ETH_TXD0  (via drill 0.25)
  Top 0.152: IC1.3 41.63,33.37 v41.02,32.77 | U1.51 19.02,23.02 v18.41,23.62
  Bottom 0.152: v41.02,32.77 33.02,32.77 23.24,22.99 19.05,22.99 v18.41,23.62
ETH_TXD1  (via drill 0.25)
  Top 0.152: IC1.4 42.53,32.87 v41.28,31.62 | U1.52 18,22.52 v16.89,23.62
  Bottom 0.152: v41.28,31.62 32.89,31.62 25.53,24.26 25.4,24.26 23.75,22.61 23.62,22.48 18.03,22.48 v16.89,23.62
ETH_TXD2  (via drill 0.25)
  Top 0.152: U1.17 37.56,19.02 38.35,19.81 41.91,19.81 42.8,19.81 v43.94,20.96 | v51.05,31.75 51.69,32.39 56.95,32.39 IC1.5
  Bottom 0.152: v43.94,20.96 43.94,24.64 v51.05,31.75
ETH_TXD3  (via drill 0.25)
  Top 0.152: IC1.6 53.46,31.87 52.32,30.73 v46.61,30.73 | U1.95 31.95,13.02 v32,13.08
  Bottom 0.152: v32,13.08 31.11,13.97 31.11,21.97 32.77,23.62 39.5,23.62 39.75,23.88 v46.61,30.73
GND
  pour Top: 0,0 78.74,0 78.74,50.8 0,50.8
N$1
  Top 0.152: C1.1 69.51,34.24 Q1.P$1 67.64,33.98 67.56,33.91 67.03,33.37 IC1.34
N$2
  Top 0.152: C2.1 71.21,32.05 Q1.P$3 71.2,32.56 71.12,32.64 70.89,32.87 IC1.33
N$3
  Top 0.152: U1.94 31.45,7.54 TP6.TP R12.1
N$4
  Top 0.152: IC1.28 66.91,30.37 67.44,29.85 67.44,28.58 68.07,27.94 68.2,27.81 R7.2
N$5
  Top 0.152: IC1.24 65.2,27.37 R1.2
N$6
  Top 0.152: IC1.27 66.77,29.87 67.06,29.59 67.06,28.45 68.07,27.43 68.71,26.8 R6.2
N$7
  Top 0.152: IC1.26 66.26,29.37 66.67,28.96 66.67,28.32 68.07,26.92 69.21,25.78 R8.2
N$8
  Top 0.152: U1.81 24.95,4.52 TP3.TP
N$9
  Top 0.152: IC1.21 62.46,24.15 62.48,24.13 62.74,23.88 R9.2
N$10
  Top 0.203: U1.49 22.99,24.76 22.99,26.04 22.99,26.8 C12.2
N$11
  Top 0.152: Q2.P$1 39.38,16.69 C14.2 38.39,16.68 38.35,16.64 38.24,16.52 U1.12
N$12
  Top 0.152: C15.2 43.52,18.38 Q2.P$3 43.51,17.86 43.43,17.78 43.18,17.53 38.61,17.53 38.1,17.02 U1.13
N$13
  Top 0.152: U1.9 40.33,15.02 Q3.X2 40.41,14.99 C17.2
N$14
  Top 0.152: U1.73 19.26,12.02 18.54,11.3 18.41,11.18 C13.2
N$15
  Top 0.152: U1.8 38.31,14.52 38.35,14.48 39.12,13.72 40.01,13.72 40.39,13.34 Q3.X1 40.41,12.45 C16.2
N$16
  Top 0.152: U1.82 25.45,5.41 25.78,5.08 TP4.TP
N$17
  Top 0.152: U1.29 32.95,26.09 TP7.TP
N$18
  Top 0.152: U1.42 26.45,26.26 TP8.TP
N$19
  Top 0.152: 25.95,27.47 TP9.TP 25.78,27.3 25.78,25.91 25.95,25.74 U1.43
N$20
  Top 0.152: U1.88 28.45,7.24 TP18.TP
N$21
  Top 0.152: U1.90 29.45,7.6 TP11.TP
N$22
  Top 0.152: U1.85 26.95,8.23 27.18,8 27.18,5.84 TP21.TP
N$23
  Top 0.152: U1.86 27.45,8.24 27.56,8.13 27.56,6.35 TP20.TP
N$24
  Top 0.152: U1.87 27.95,6.85 TP19.TP
N$25
  Top 0.152: TP17.TP 18.68,16.02 U1.65
N$26
  Top 0.152: TP16.TP 17.91,16.52 18.03,16.64 19.43,16.64 19.55,16.52 U1.64
N$27
  Top 0.152: IC1.20 61.96,23.63 62.74,22.86 R10.2
N$28
  Top 0.152: U1.63 TP15.TP
N$29
  Top 0.152: U1.60 17.38,18.52 17.27,18.42 16.51,18.42 TP12.TP
N$31
  Top 0.152: TP13.TP 17.02,21.97 18.29,20.7 18.47,20.52 U1.56
N$32
  Top 0.152: U1.57 18.46,20.02 17.4,21.08 17.27,21.21 TP10.TP
N$33  (via drill 0.25)
  Top 0.203: C8.1 65.15,26.42 64.26,26.42 63.75,26.42 63.46,26.71 IC1.23 63.46,28.79 v63.5,28.83 | v60.96,28.83 IC1.18 60.96,26.49 C9.1 | 63.96,34.63 IC1.37 63.96,36.58 63.96,36.66 64.14,36.83 C10.1
  Top 0.406: C8.1 66.65,25.98 C11.+
  Top 0.61: 66.67,26 C11.+ | 63.96,34.63 62.99,33.66 62.99,29.72 62.99,29.34 v63.5,28.83
  Bottom 0.813: v60.96,28.83 v63.5,28.83
N$34
  Top 0.152: U1.58 19.09,19.52 18.92,19.69 18.29,19.69 17.53,20.45 TP22.TP
N$35
  Top 0.152: U1.59 17.94,19.02 TP23.TP
N$36
  Top 0.152: TP24.TP 18.91,18.02 U1.61
PA5  (via drill 0.25)
  Top 0.152: U1.30 32.45,26.73 v32.77,27.05 | 6.98,13.97 MOD1.15 | v17.91,17.65 16.13,17.65 13.84,15.37 8.38,15.37 6.98,13.97 | U2.6 6.48,10.8 6.98,11.3 6.98,13.97
  Bottom 0.152: v32.77,27.05 30.35,27.05 28.96,25.65 28.96,19.18 28.19,18.42 21.72,18.42 18.67,18.42 v17.91,17.65
PA6  (via drill 0.25)
  Top 0.152: U1.31 31.95,27.38 v32.64,28.07 | MOD1.14 5.08,16.51 v13.59,16.51 16.26,19.05 v16.76,19.05 | v12.83,9.52 U2.2
  Bottom 0.152: v32.64,28.07 30.35,28.07 29.46,27.18 28.32,26.04 28.32,22.35 28.32,19.69 27.69,19.05 21.34,19.05 v16.76,19.05 | v13.59,16.51 13.59,10.29 v12.83,9.52
PA11  (via drill 0.25)
  Top 0.152: U1.70 17.71,13.52 v17.4,13.21 | v37.59,4.83 37.97,4.45 41.53,4.45 42.8,5.72 44.83,5.72 v45.21,5.33 | v72.9,37.97 72.9,42.42 MOD1.39
  Bottom 0.152: v17.4,13.21 17.4,6.73 17.78,6.35 36.2,6.35 v37.59,4.83 | v45.21,5.33 45.47,5.08 48.01,5.08 67.94,5.08 72.9,10.03 72.9,11.56 72.9,12.32 v72.9,37.97
PA12  (via drill 0.25)
  Top 0.152: U1.71 18.86,13.02 v18.41,12.57 | v38.23,5.84 41.91,5.84 42.42,6.35 v45.97,6.35 | v73.79,40.77 74.17,41.15 MOD1.38
  Bottom 0.152: v18.41,12.57 18.41,7.24 18.67,6.98 26.42,6.98 37.08,6.98 v38.23,5.84 | v45.97,6.35 46.61,5.72 48.13,5.72 50.8,5.72 67.69,5.72 72.14,10.16 72.14,38.48 72.14,39.12 v73.79,40.77
PA15  (via drill 0.25)
  Top 0.152: U1.77 22.95,3.77 21.97,2.79 6.98,2.79 v4.57,5.21
  Bottom 0.152: v4.57,5.21 4.57,8.26 MOD1.16
PA_1
  Top 0.152: R15.2 25.93,49.36 LED1.C
PB5  (via drill 0.25)
  Top 0.152: U1.91 29.97,9.29 29.97,2.79 29.97,2.29 v30.99,1.27 | U2.5 4.64,12.63 v4.19,13.08
  Bottom 0.152: MOD1.13 5.21,14.99 5.21,13.08 | 5.21,13.08 5.21,6.35 10.67,1.02 26.8,1.02 30.61,1.02 v30.99,1.27 | v4.19,13.08 5.21,13.08
PB6  (via drill 0.25)
  Top 0.152: U1.92 30.48,9.29 30.48,3.3 30.48,3.05 v30.99,2.54 32,2.54 32.26,2.29 R13.1 | IC4.6 6.35,23.5 4.45,21.59 MOD1.12
  Bottom 0.152: MOD1.12 6.86,16 6.86,5.97 11.18,1.65 28.07,1.65 29.34,1.65 30.1,1.65 v30.99,2.54
PB7  (via drill 0.25)
  Top 0.152: U1.93 30.99,9.28 30.99,4.45 v31.24,4.19 31.24,3.56 31.88,2.92 33.15,2.92 33.4,2.67 R14.1 | IC4.5 5.97,24.77 5.33,24.13 MOD1.11
  Bottom 0.152: MOD1.11 7.62,17.78 7.62,6.35 11.68,2.29 26.8,2.29 28.96,2.29 29.34,2.29 v31.24,4.19
PB8  (via drill 0.25)
  Top 0.152: U1.67 15.72,15.02 v15.37,15.37 | v36.58,2.54 42.55,2.54 v43.82,3.81
  Bottom 0.152: v15.37,15.37 15.37,6.1 16.38,5.08 34.04,5.08 v36.58,2.54 | v43.82,3.81 68.58,3.81 76.2,11.43 76.2,20.32 MOD1.29
PB14  (via drill 0.25)
  Top 0.152: U1.53 28.53,22.02 v34.04,16.51 | MOD1.27 74.17,16.51 71.88,14.22 71.88,7.11 70.87,6.1 49.28,6.1 47.5,7.87 47.5,15.75 v46.74,16.51
  Bottom 0.152: v34.04,16.51 v46.74,16.51
PB15  (via drill 0.25)
  Top 0.152: v32.77,16.51 27.76,21.52 U1.54 | MOD1.28 75.82,19.05 72.39,15.62 68.83,15.62 64.9,11.68 64.9,8.26 64.9,7.49 64.14,6.73 49.53,6.73 48.13,8.13 48.13,15.62 48.13,16.76 v47.5,17.4
  Bottom 0.152: v47.5,17.4 33.66,17.4 v32.77,16.51
PC0  (via drill 0.25)
  Top 0.152: v30.48,22.86 30.48,22.23 33.27,19.43 34.69,18.02 U1.15 36.16,18.03 37.47,18.03 TP5.TP | 19.68,6.35 20.07,6.73 | 20.07,6.73 v21.34,8 | MOD1.18 4.95,6.35 6.48,4.83 18.16,4.83 20.07,6.73
  Bottom 0.152: v30.48,22.86 30.48,17.15 v21.34,8
PC9  (via drill 0.25)
  Top 0.152: v16.13,16.38 16.99,15.52 17.14,15.37 19.43,15.37 19.58,15.52 U1.66 | v36.58,3.81 41.78,3.81 42.16,3.81 v43.31,4.95
  Bottom 0.152: v16.13,16.38 16.51,16 16.51,12.7 16.51,6.22 17.02,5.72 34.54,5.72 v36.58,3.81 | v43.31,4.95 44.32,4.95 44.83,4.45 68.2,4.45 74.04,10.29 74.3,10.54 75.44,11.68 75.44,21.21 75.44,22.1 MOD1.30
PC10  (via drill 0.25)
  Top 0.152: U1.78 23.45,3.51 22.22,2.29 7.87,2.29 4.45,2.29 v3.43,3.3
  Bottom 0.152: v3.43,3.3 3.43,6.73 MOD1.17
PC11
  Top 0.152: U1.79 23.95,3.25 22.48,1.78 3.3,1.78 MOD1.19
PC12
  Top 0.152: U1.80 24.45,3.11 22.61,1.27 MOD1.20
PD3  (via drill 0.25)
  Top 0.152: U1.84 26.45,7.72 v26.54,7.62 | MOD1.26 75.95,13.97 74.93,14.99 73.53,14.99 72.52,13.97 72.52,6.86 71.12,5.46 48.77,5.46 48.64,5.59 46.61,7.62 v37.97,7.62
  Bottom 0.152: v26.54,7.62 28.45,7.62 37.59,7.62 v37.97,7.62
PE0  (via drill 0.25)
  Top 0.152: U1.97 32.95,4.14 34.16,2.92 36.07,1.02 73.91,1.02 75.56,2.67 75.56,11.56 75.56,11.94 v74.55,12.95
  Bottom 0.152: v74.55,12.95 74.55,23.75 MOD1.31
PE1  (via drill 0.25)
  Top 0.152: U1.98 33.45,4.52 33.53,4.45 36.32,1.65 73.66,1.65 74.93,2.92 74.93,10.8 v73.53,12.19
  Bottom 0.152: v73.53,12.19 73.53,25.27 MOD1.32
PE2  (via drill 0.25)
  Top 0.152: U1.1 37.12,11.02 v38.74,9.4
  Bottom 0.152: MOD1.21 39.62,1.27 38.99,1.91 38.99,9.14 v38.74,9.4
PE3  (via drill 0.25)
  Top 0.152: U1.2 37.5,11.52 v38.74,10.29
  Bottom 0.152: MOD1.22 75.31,1.65 74.55,1.65 39.75,1.65 39.37,2.03 39.37,8.76 39.37,9.14 39.37,9.65 v38.74,10.29
PE4  (via drill 0.25)
  Top 0.152: U1.3 37.89,12.02 v38.74,11.18
  Bottom 0.152: MOD1.23 73.15,2.03 71.75,2.03 40.01,2.03 39.75,2.29 39.75,8.76 39.75,9.02 39.75,10.16 v38.74,11.18
PE5  (via drill 0.25)
  Top 0.152: U1.4 38.28,12.52 v38.74,12.06
  Bottom 0.152: v38.74,12.06 40.13,10.67 40.13,8.26 40.13,2.54 40.26,2.41 70.99,2.41 MOD1.24
PE6  (via drill 0.25)
  Top 0.152: U1.5 38.67,13.02 v38.74,12.95
  Bottom 0.152: v38.74,12.95 40.51,11.18 40.51,9.27 40.51,2.92 40.64,2.79 68.83,2.79 MOD1.25
PE7  (via drill 0.25)
  Top 0.152: MOD1.10 17.14,26.67 v19.94,29.46 | v28.57,31.5 28.45,31.37 U1.38
  Bottom 0.152: v19.94,29.46 26.54,29.46 v28.57,31.5
PE8  (via drill 0.25)
  Top 0.152: MOD1.9 17.53,29.21 v18.92,30.61 | v28.57,32.77 27.69,31.88 27.69,25.91 27.95,25.65 U1.39
  Bottom 0.152: v18.92,30.61 26.42,30.61 v28.57,32.77
PE9  (via drill 0.25)
  Top 0.152: MOD1.33 75.69,29.97 75.69,23.11 75.69,20.83 75.69,19.81 72.14,16.26 68.58,16.26 64.26,11.94 64.26,8 63.63,7.37 49.91,7.37 48.77,8.51 48.77,15.62 48.77,17.78 v48.26,18.29 | U1.40 27.45,23.23 27.94,22.73 29.08,22.73 v33.53,18.29
  Bottom 0.152: v33.53,18.29 v48.26,18.29
PE10  (via drill 0.25)
  Top 0.152: U1.41 26.95,36.3 26.95,36.98 32.77,42.8 32.89,42.8 44.7,42.8 48.64,42.8 50.17,44.32 v51.44,44.32
  Bottom 0.152: MOD1.34 74.93,36.83 74.93,41.53 72.14,44.32 51.94,44.32 v51.44,44.32
PE13  (via drill 0.25)
  Top 0.152: U1.44 25.45,37.13 25.53,37.21 31.75,43.43 32.51,43.43 44.7,43.43 48.39,43.43 49.78,44.83 50.17,45.21 v50.55,45.21
  Bottom 0.152: MOD1.35 75.56,38.73 75.56,41.91 72.26,45.21 v50.55,45.21
PE14  (via drill 0.25)
  Top 0.152: U1.45 24.95,37.27 26.67,38.99 31.5,43.81 44.7,43.81 47.88,43.81 50.29,46.23 v51.44,46.23
  Bottom 0.152: v51.44,46.23 72.14,46.23 76.2,42.16 76.2,40.64 MOD1.36
PE15  (via drill 0.25)
  Top 0.152: U1.46 24.45,37.4 31.24,44.2 44.7,44.2 47.24,44.2 v50.55,47.37
  Bottom 0.152: MOD1.37 72.01,47.37 v50.55,47.37
RD+
  Top 0.152: CON1.4 61.21,22.1 60.45,22.86 59.69,22.86 59.18,23.37 58.96,23.59 58.96,25.57 R4.1
  Top 0.203: IC1.14 58.96,25.74 R4.1
RD-  (via drill 0.25)
  Top 0.152: v60.58,20.45 60.58,21.97 60.2,22.35 59.69,22.35 58.46,23.58 58.46,24.61 R5.1 58.42,24.71 58.42,26.67 58.46,26.71 IC1.13
  Bottom 0.152: v60.58,20.45 63.5,20.45 63.75,20.19 CON1.6
SD_CS  (via drill 0.25)
  Top 0.152: U1.83 25.95,5.8 v27.43,4.32 | v14.1,8.26 U2.1
  Bottom 0.152: v27.43,4.32 16.26,4.32 14.61,5.97 14.61,7.75 v14.1,8.26
TD+
  Top 0.152: IC1.17 60.46,23.99 60.71,23.75 60.71,23.24 61.6,22.35 61.6,21.21 | 61.6,21.21 61.6,20.32 62.48,19.43 62.48,18.16 61.98,17.65 61.21,16.89 61.21,15.49 60.83,15.11 58.67,15.11 CON1.1 | R2.1 61.72,21.34 61.6,21.21
TD-  (via drill 0.25)
  Top 0.152: 59.94,27.35 IC1.16 59.94,27.35 | v59.94,23.62 59.94,27.35 | v59.94,21.72 CON1.3
  Top 0.406: v59.94,21.72 R3.1
  Bottom 0.152: v59.94,23.62 v59.94,21.72
TGT_NRST  (via drill 0.25)
  Top 0.152: CON2.3 16.89,48.13 16.89,47.62 16.89,44.83 16.89,37.72 16,36.83 v8.89,36.83 MOD1.6 | U1.14 35.04,17.52 34.8,17.27 34.8,16.13 34.04,15.37 v31.88,15.37 30.35,15.37 29.08,15.37 v27.94,16.51 | IC1.29 64.53,30.87 v64.01,30.35
  Bottom 0.152: v27.94,16.51 18.03,16.51 13.59,20.96 13.59,32.13 v8.89,36.83 | v64.01,30.35 53.72,30.35 48.39,25.02 48.39,20.7 47.62,19.94 33.78,19.94 32.64,18.8 31.88,18.03 v31.88,15.37
TGT_RX  (via drill 0.25)
  Top 0.152: v9.14,14.48 9.18,14.52 U1.68
  Bottom 0.152: MOD1.8 9.14,23.88 v9.14,14.48
TGT_SWCLK  (via drill 0.25)
  Top 0.152: CON2.4 17.53,44.32 17.53,37.34 15.88,35.69 9.27,35.69 v5.08,35.69 | v12.7,11.18 14.56,9.32 U1.76
  Bottom 0.152: v5.08,35.69 11.81,28.83 11.81,12.06 v12.7,11.18
  Bottom 0.203: MOD1.5 v5.08,35.69
TGT_SWDIO  (via drill 0.25)
  Top 0.152: U1.72 19.25,12.52 18.67,11.94 13.97,11.94 13.59,11.94 v12.83,12.7 | CON2.2 18.16,46.86 18.16,44.7 18.16,43.43 18.16,37.08 15.75,34.67 v8.51,34.67
  Bottom 0.152: v8.51,34.67 12.83,30.35 v12.83,12.7
  Bottom 0.203: MOD1.4 v8.51,34.67
TGT_SWO  (via drill 0.25)
  Top 0.152: CON2.6 16.26,45.72 v15.49,44.96 | U1.89 28.95,13.34 26.16,16.13 26.16,19.56 v25.27,20.45
  Bottom 0.152: v25.27,20.45 16.89,20.45 14.35,22.99 14.35,32.89 14.35,43.81 v15.49,44.96
TGT_TX  (via drill 0.25)
  Top 0.152: v10.16,13.46 10.72,14.02 U1.69
  Bottom 0.152: MOD1.7 10.16,25.4 v10.16,13.46

### Text on the board
tPlace: GND / 3V3 / / TGT_SWDIO / TGT_SWCLK / TGT_NRESET / TGT_TX / TGT_RX / PE8 / PE7 / PB7 / PB6 / PB5 / PA6 / PA5 / / / PC0 / PC11 / PC12 | GND / PA11 / PA12 / PE15 / PE14 / PE13 / PE10 / PE9 / PE1 / PE0 / PC9 / PB8 / PB15 / PB14 / PD3 / PE6 / PE5 / PE4 / PE3 / PE2 | Module Carrier Board / STM32F429VIT6 / v1.0.0